# Altium project WSBR_Board.PrjPcb
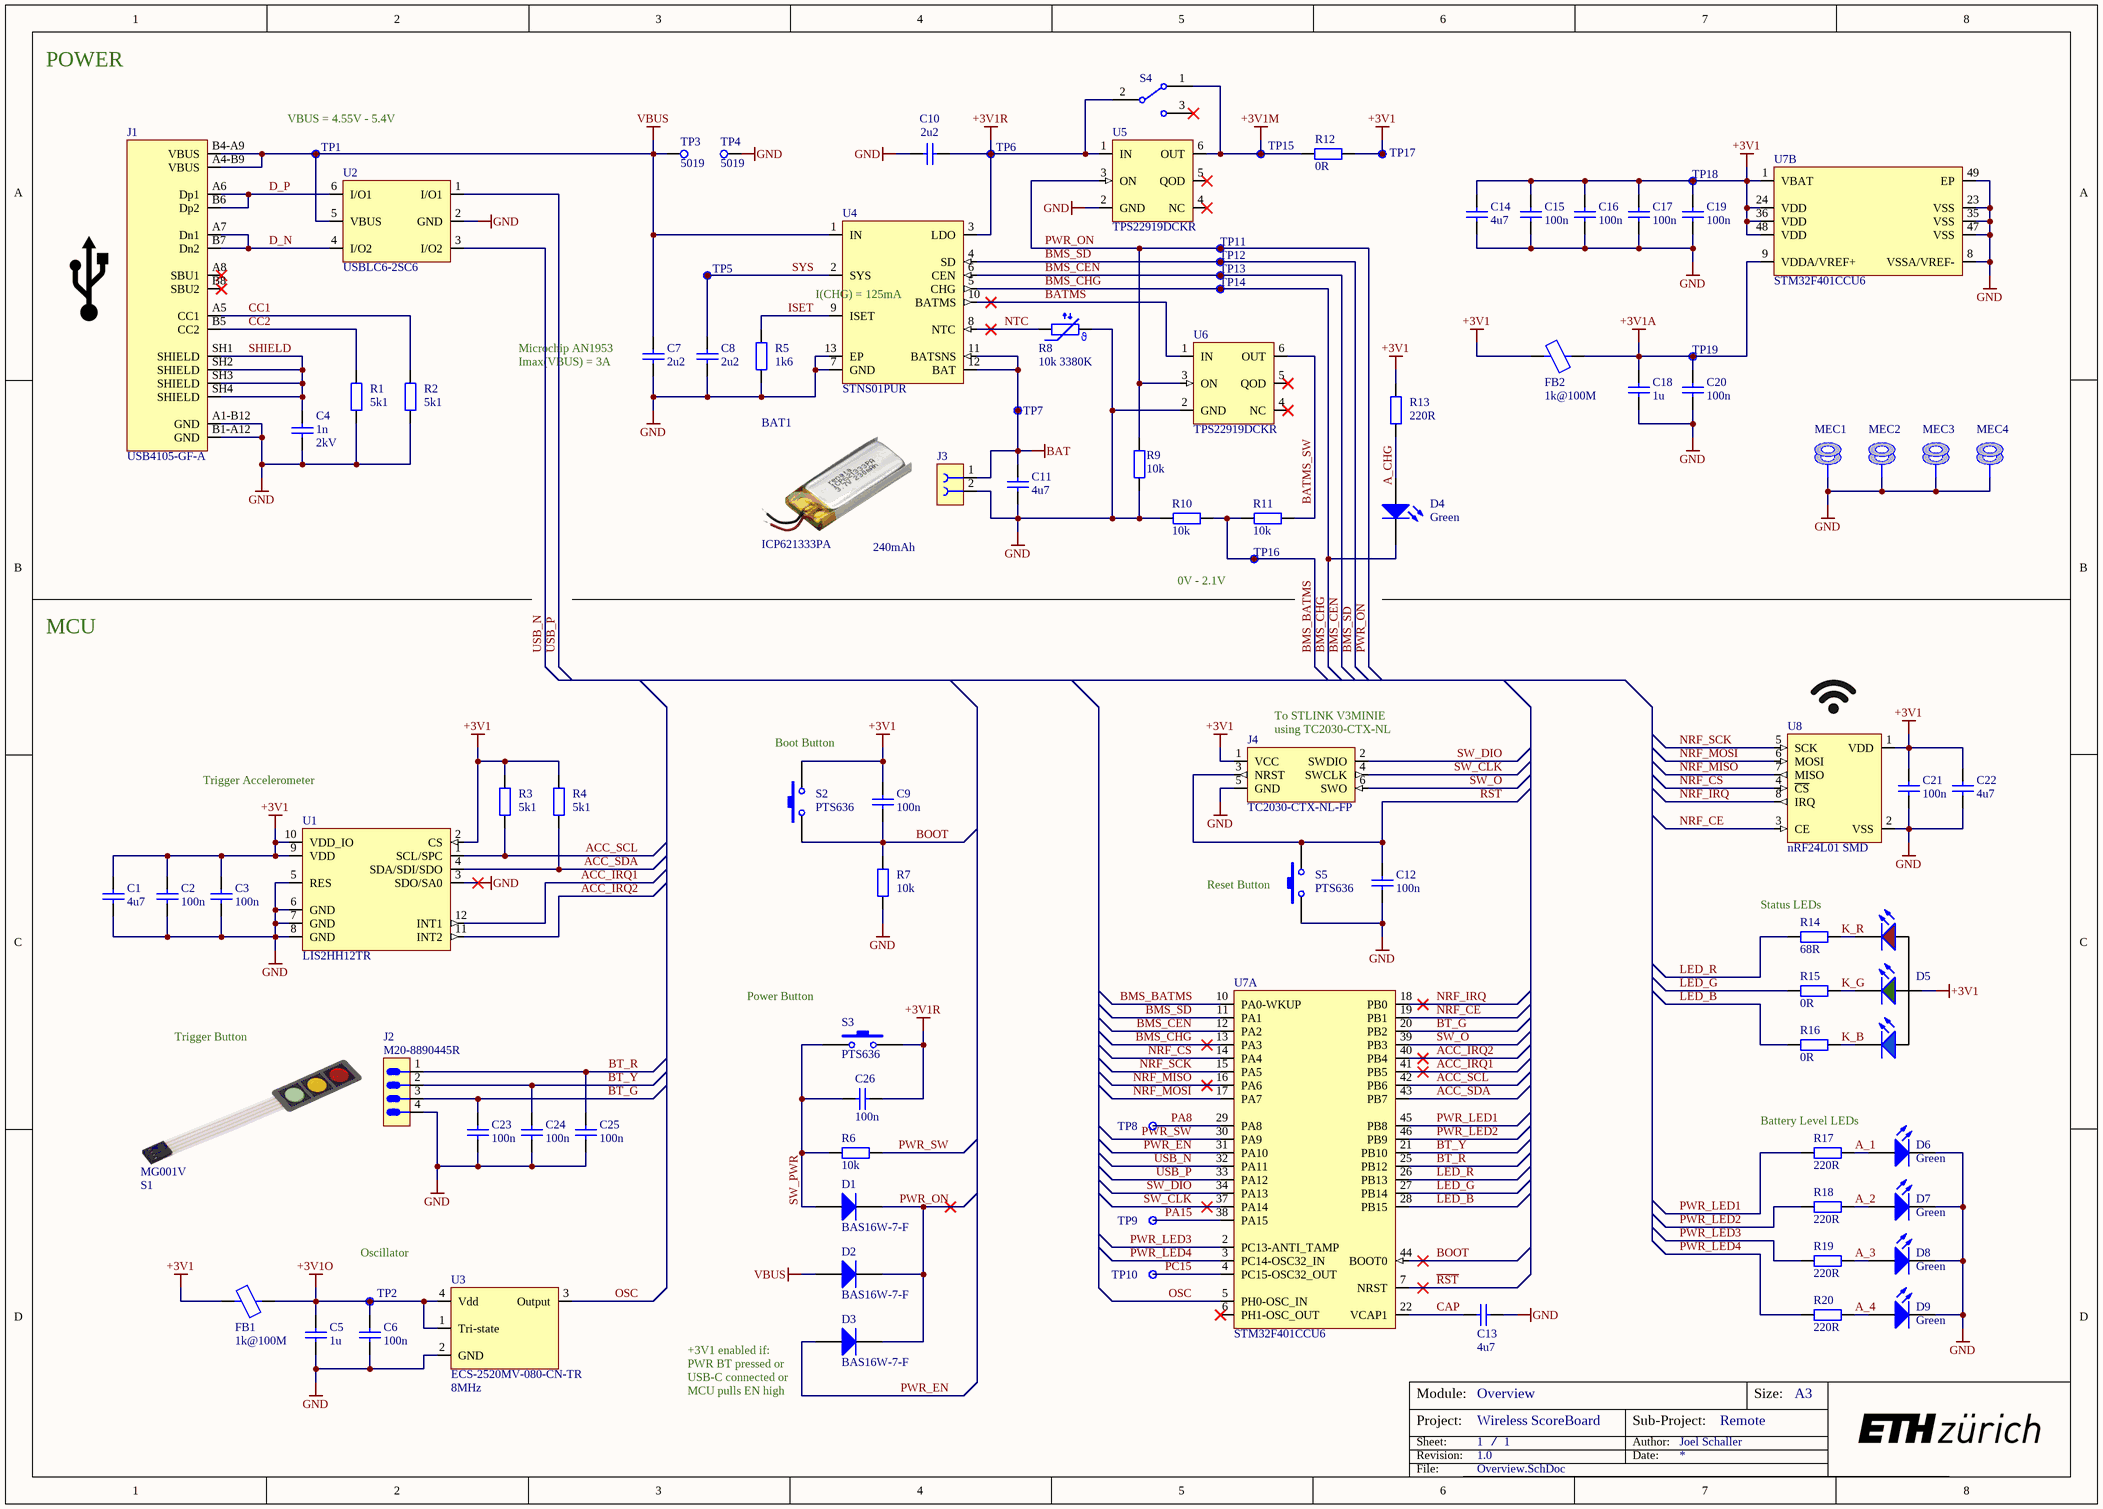
[diagram p0: Overview.SchDoc]
Author: Joel Schaller; Project: Wireless ScoreBoard; Revision: 1.0; SubProject: Remote
1 sheet, 98 parts. Net scope: global (net labels, ports and power ports of the same name join across sheets).
Board file: WSBR_Board.PcbDoc

## Sheet Overview.SchDoc
size A3; SheetNumber: 1; SheetTotal: 1; Module: Overview

### Parts
BAT1  ICP621333PA  value 240mAh  (mechanical)
C1  value 4u7  [SMD_CAPC2012X12N]  (hidden comment: C0805)
C2  value 100n  [SMD_CAPC1005X06N]  (hidden comment: C0402)
C3  value 100n  [SMD_CAPC1005X06N]  (hidden comment: C0402)
C4  value 1n  Note: 2kV  [SMD_CAPC3216X16N]  (hidden comment: C1206)
C5  value 1u  [SMD_CAPC2012X12N]  (hidden comment: C0805)
C6  value 100n  [SMD_CAPC1005X06N]  (hidden comment: C0402)
C7  value 2u2  [SMD_CAPC2012X12N]  (hidden comment: C0805)
C8  value 2u2  [SMD_CAPC2012X12N]  (hidden comment: C0805)
C9  value 100n  [SMD_CAPC1005X06N]  (hidden comment: C0402)
C10  value 2u2  [SMD_CAPC2012X12N]  (hidden comment: C0805)
C11  value 4u7  [SMD_CAPC2012X12N]  (hidden comment: C0805)
C12  value 100n  [SMD_CAPC1005X06N]  (hidden comment: C0402)
C13  value 4u7  [SMD_CAPC2012X12N]  (hidden comment: C0805)
C14  value 4u7  [SMD_CAPC2012X12N]  (hidden comment: C0805)
C15  value 100n  [SMD_CAPC1005X06N]  (hidden comment: C0402)
C16  value 100n  [SMD_CAPC1005X06N]  (hidden comment: C0402)
C17  value 100n  [SMD_CAPC1005X06N]  (hidden comment: C0402)
C18  value 1u  [SMD_CAPC2012X12N]  (hidden comment: C0805)
C19  value 100n  [SMD_CAPC1005X06N]  (hidden comment: C0402)
C20  value 100n  [SMD_CAPC1005X06N]  (hidden comment: C0402)
C21  value 100n  [SMD_CAPC1005X06N]  (hidden comment: C0402)
C22  value 4u7  [SMD_CAPC2012X12N]  (hidden comment: C0805)
C23  value 100n  [SMD_CAPC1005X06N]  (hidden comment: C0402)
C24  value 100n  [SMD_CAPC1005X06N]  (hidden comment: C0402)
C25  value 100n  [SMD_CAPC1005X06N]  (hidden comment: C0402)
C26  value 100n  [SMD_CAPC1005X06N]  (hidden comment: C0402)
D1  BAS16W-7-F  [SOT323 SC70]
D2  BAS16W-7-F  [SOT323 SC70]
D3  BAS16W-7-F  [SOT323 SC70]
D4  value Green  [SMD_LED_0402]  (hidden comment: APHHS1005LZGCK-V)
D5  APHF1608SEEQBDZGKC  [APHF1608SEEQBDZGKC]  (value not drawn)
D6  value Green  [SMD_LED_0402]  (hidden comment: APHHS1005LZGCK-V)
D7  value Green  [SMD_LED_0402]  (hidden comment: APHHS1005LZGCK-V)
D8  value Green  [SMD_LED_0402]  (hidden comment: APHHS1005LZGCK-V)
D9  value Green  [SMD_LED_0402]  (hidden comment: APHHS1005LZGCK-V)
FB1  value 1k@100M  [SMD_RESC1005X04N]  (hidden comment: BLM15BD102SN1D)
FB2  value 1k@100M  [SMD_RESC1005X04N]  (hidden comment: BLM15BD102SN1D)
J1  USB4105-GF-A  [USB4105-GF-A]
J2  M20-8890445R  [M20-8890445R]
J3  CONN SMD-PAD 2-Poles 1.6mm SMD  [CONN SMD-PAD 2-Poles 1.6mm SMD]  (value not drawn)  (no BOM)
J4  TC2030-CTX-NL-FP  [SMD_TAG-CONNECT_TC2030-CTX-NL]  (no BOM)
MEC1  Generic Screw Hole  [Screw M3 ISO 7380-1]  (value not drawn)  (no BOM)
MEC2  Generic Screw Hole  [Screw M3 ISO 7380-1]  (value not drawn)  (no BOM)
MEC3  Generic Screw Hole  [Screw M3 ISO 7380-1]  (value not drawn)  (no BOM)
MEC4  Generic Screw Hole  [Screw M3 ISO 7380-1]  (value not drawn)  (no BOM)
R1  value 5k1  [SMD_RESC1005X04N]  (hidden comment: R0402)
R2  value 5k1  [SMD_RESC1005X04N]  (hidden comment: R0402)
R3  value 5k1  [SMD_RESC1005X04N]  (hidden comment: R0402)
R4  value 5k1  [SMD_RESC1005X04N]  (hidden comment: R0402)
R5  value 1k6  [SMD_RESC1005X04N]  (hidden comment: R0402)
R6  value 10k  [SMD_RESC1005X04N]  (hidden comment: R0402)
R7  value 10k  [SMD_RESC1005X04N]  (hidden comment: R0402)
R8  value 10k 3380K  [SMD_RESC1005X04N]  (hidden comment: NCU15XH103F6SRC)
R9  value 10k  [SMD_RESC1005X04N]  (hidden comment: R0402)
R10  value 10k  [SMD_RESC1005X04N]  (hidden comment: R0402)
R11  value 10k  [SMD_RESC1005X04N]  (hidden comment: R0402)
R12  value 0R  [SMD_RESC1608X05N]  (hidden comment: R0603)
R13  value 220R  [SMD_RESC1005X04N]  (hidden comment: R0402)
R14  value 68R  [SMD_RESC1608X05N]  (hidden comment: R0603)
R15  value 0R  [SMD_RESC1608X05N]  (hidden comment: R0603)
R16  value 0R  [SMD_RESC1608X05N]  (hidden comment: R0603)
R17  value 220R  [SMD_RESC1005X04N]  (hidden comment: R0402)
R18  value 220R  [SMD_RESC1005X04N]  (hidden comment: R0402)
R19  value 220R  [SMD_RESC1005X04N]  (hidden comment: R0402)
R20  value 220R  [SMD_RESC1005X04N]  (hidden comment: R0402)
S1  MG001V  (mechanical)
S2  PTS636  [PTS636 SK43 SMTR LFS]
S3  PTS636  [PTS636 SK43 SMTR LFS]
S4  OS102011MS2QN1  [THT_SLIDESWITCH_86X43]  (value not drawn)
S5  PTS636  [PTS636 SK43 SMTR LFS]
TP1  Test Point  [SMD_PAD_1mm]  (value not drawn)  (no BOM)
TP2  Test Point  [SMD_PAD_1mm]  (value not drawn)  (no BOM)
TP3  5019  [KEYSTONE_5019]
TP4  5019  [KEYSTONE_5019]
TP5  Test Point  [SMD_PAD_1mm]  (value not drawn)  (no BOM)
TP6  Test Point  [SMD_PAD_1mm]  (value not drawn)  (no BOM)
TP7  Test Point  [SMD_PAD_1mm]  (value not drawn)  (no BOM)
TP8  Test Point  [SMD_PAD_1mm]  (value not drawn)  (no BOM)
TP9  Test Point  [SMD_PAD_1mm]  (value not drawn)  (no BOM)
TP10  Test Point  [SMD_PAD_1mm]  (value not drawn)  (no BOM)
TP11  Test Point  [SMD_PAD_1mm]  (value not drawn)  (no BOM)
TP12  Test Point  [SMD_PAD_1mm]  (value not drawn)  (no BOM)
TP13  Test Point  [SMD_PAD_1mm]  (value not drawn)  (no BOM)
TP14  Test Point  [SMD_PAD_1mm]  (value not drawn)  (no BOM)
TP15  Test Point  [SMD_PAD_1mm]  (value not drawn)  (no BOM)
TP16  Test Point  [SMD_PAD_1mm]  (value not drawn)  (no BOM)
TP17  Test Point  [SMD_PAD_1mm]  (value not drawn)  (no BOM)
TP18  Test Point  [SMD_PAD_1mm]  (value not drawn)  (no BOM)
TP19  Test Point  [SMD_PAD_1mm]  (value not drawn)  (no BOM)
U1  LIS2HH12TR  [LIS2HH12TR]
U2  USBLC6-2SC6  [SOT95P280X145-6N]
U3  ECS-2520MV-080-CN-TR  value 8MHz  [SMD_XTAL2520]
U4  STNS01PUR  [SON45P300X80_HS-13N]
U5  TPS22919DCKR  [SOT65P210X110-6N]
U6  TPS22919DCKR  [SOT65P210X110-6N]
U7  STM32F401CCU6  [QFN50P700X700X60_HS-49N]  (parts A,B of 2)
U8  nRF24L01 SMD  [nRF24L01 SMD]

### Nets
+3V1: C1.2 C2.2 C3.2 C9.2 C14.2 C15.2 C16.2 C17.2 C19.2 C21.2 C22.2 D5.1(A) FB1.1 FB2.1 J4.1(VCC) R3.2 R4.2 R12.1 R13.2 S2.2 TP17.1 TP18.1 U1.2(CS) U1.9(VDD) U1.10(VDD_IO) U7.1(VBAT) U7.24(VDD) U7.36(VDD) U7.48(VDD) U8.1(VDD)
+3V1A: C18.2 C20.2 FB2.2 TP19.1 U7.9(VDDA/VREF+)
+3V1M: R12.2 S4.1 TP15.1 U5.6(OUT)
+3V1O: C5.2 C6.2 FB1.2 TP2.1 U3.1(Tri-state) U3.4(Vdd)
+3V1R: C10.1 C26.1 S3.1 S4.2 TP6.1 U4.3(LDO) U5.1(IN)
BAT: C11.2 J3.1 TP7.1 U4.11(BATSNS) U4.12(BAT)
GND: C1.1 C2.1 C3.1 C4.1 C5.1 C6.1 C7.1 C8.1 C10.2 C11.1 C12.1 C13.1 C14.1 C15.1 C16.1 C17.1 C18.1 C19.1 C20.1 C21.1 C22.1 C23.1 C24.1 C25.1 D6.1(K) D7.1(K) D8.1(K) D9.1(K) J1.A1-B12(GND) J1.B1-A12(GND) J2.4 J3.2 J4.5(GND) MEC1.1 MEC2.1 MEC3.1 MEC4.1 R1.1 R2.1 R5.2 R7.2 R8.2 R9.1 R10.1 S5.1 TP4.1 U1.3(SDO/SA0) U1.5(RES) U1.6(GND) U1.7(GND) U1.8(GND) U2.2(GND) U3.2(GND) U4.7(GND) U4.13(EP) U5.2(GND) U6.2(GND) U7.8(VSSA/VREF-) U7.23(VSS) U7.35(VSS) U7.47(VSS) U7.49(EP) U8.2(VSS)
VBUS: C7.2 D2.1(A) J1.A4-B9(VBUS) J1.B4-A9(VBUS) TP1.1 TP3.1 U2.5(VBUS) U4.1(IN)
A_1: D6.2(A) R17.1
A_2: D7.2(A) R18.1
A_3: D8.2(A) R19.1
A_4: D9.2(A) R20.1
A_CHG: D4.2(A) R13.1
ACC_IRQ1: U1.12(INT1) U7.41(PB5)
ACC_IRQ2: U1.11(INT2) U7.40(PB4)
ACC_SCL: R3.1 U1.1(SCL/SPC) U7.42(PB6)
ACC_SDA: R4.1 U1.4(SDA/SDI/SDO) U7.43(PB7)
~{BMS_CHG}: D4.1(K) TP14.1 U4.5(CHG) U7.13(PA3)
BATMS: U4.10(BATMS) U6.1(IN)
BATMS_SW: R11.2 U6.6(OUT)
BMS_BATMS: R10.2 R11.1 TP16.1 U7.10(PA0-WKUP)
BMS_CEN: TP13.1 U4.6(CEN) U7.12(PA2)
BMS_SD: TP12.1 U4.4(SD) U7.11(PA1)
BOOT: C9.1 R7.1 S2.1 U7.44(BOOT0)
BT_G: C23.2 J2.3 U7.20(PB2)
BT_R: C25.2 J2.1 U7.25(PB12)
BT_Y: C24.2 J2.2 U7.21(PB10)
CAP: C13.2 U7.22(VCAP1)
CC1: J1.A5(CC1) R2.2
CC2: J1.B5(CC2) R1.2
D_N: J1.A7(Dn1) J1.B7(Dn2) U2.4(I/O2)
D_P: J1.A6(Dp1) J1.B6(Dp2) U2.6(I/O1)
ISET: R5.1 U4.9(ISET)
K_B: D5.3(K) R16.2
K_G: D5.4(K) R15.2
K_R: D5.2(K) R14.2
LED_B: R16.1 U7.28(PB15)
LED_G: R15.1 U7.27(PB14)
LED_R: R14.1 U7.26(PB13)
~{NRF_CS}: U7.14(PA4) U8.4(~{CS})
NRF_CE: U7.19(PB1) U8.3(CE)
NRF_IRQ: U7.18(PB0) U8.8(IRQ)
NRF_MISO: U7.16(PA6) U8.7(MISO)
NRF_MOSI: U7.17(PA7) U8.6(MOSI)
NRF_SCK: U7.15(PA5) U8.5(SCK)
NTC: R8.1 U4.8(NTC)
OSC: U3.3(Output) U7.5(PH0-OSC_IN)
PA8: TP8.1 U7.29(PA8)
PA15: TP9.1 U7.38(PA15)
PC15: TP10.1 U7.4(PC15-OSC32_OUT)
PWR_EN: D3.1(A) U7.31(PA10)
PWR_LED1: R17.2 U7.45(PB8)
PWR_LED2: R18.2 U7.46(PB9)
PWR_LED3: R19.2 U7.2(PC13-ANTI_TAMP)
PWR_LED4: R20.2 U7.3(PC14-OSC32_IN)
PWR_ON: D1.3(K) D2.3(K) D3.3(K) R9.2 TP11.1 U5.3(ON) U6.3(ON)
PWR_SW: R6.2 U7.30(PA9)
~{RST}: C12.2 J4.3(NRST) S5.2 U7.7(NRST)
SHIELD: C4.2 J1.SH1(SHIELD) J1.SH2(SHIELD) J1.SH3(SHIELD) J1.SH4(SHIELD)
SW_CLK: J4.4(SWCLK) U7.37(PA14)
SW_DIO: J4.2(SWDIO) U7.34(PA13)
SW_O: J4.6(SWO) U7.39(PB3)
SW_PWR: C26.2 D1.1(A) R6.1 S3.2
SYS: C8.2 TP5.1 U4.2(SYS)
USB_N: U2.3(I/O2) U7.32(PA11)
USB_P: U2.1(I/O1) U7.33(PA12)

Not connected (* = marked no-connect by the designer): J1 A8(SBU1)* B8(SBU2)*; S4 3*; U5 4(NC)* 5(QOD)*; U6 4(NC)* 5(QOD)*; U7 6(PH1-OSC_OUT)*

### Notes on the sheet
- POWER
- VBUS = 4.55V - 5.4V
- I(CHG) = 125mA
- (near R2) Microchip AN1953
- (near R2) Imax(VBUS) = 3A
- (near TP16) 0V - 2.1V
- MCU
- Trigger Accelerometer
- Boot Button
- (near J4) To STLINK V3MINIE
  using TC2030-CTX-NL
- (near S5) Reset Button
- (near R14) Status LEDs
- Trigger Button
- (near S3) Power Button
- Battery Level LEDs
- Oscillator
- (near D3) +3V1 enabled if:
  PWR BT pressed or
  USB-C connected or
  MCU pulls EN high
- Module:
- Size:
- A3
- Revision:
- Sheet:
- Project:
- /
- Sub-Project:
- Date:
- Author:
- File:
- (in symbol CMP-02981-1) ϑ

### Library data of the parts
BAT1 = CMP-03042-1: EMECH SINGLE BATTERY LIPO; Manufacturer: Renata; Manufacturer Part Number: ICP621333PA; Supplier: Conrad; Supplier Part Number: 252027 - UP; Supplier2: Distrelec; Supplier2 Part Number: ICP621333PA-01
C1 C11 C13 C14 C22 = CMP-02451-1: CERCAP 4u7 25V 10% X7R 0805; Manufacturer: YAGEO; Manufacturer Part Number: CC0805KKX7R8BB475; Supplier: Digi-Key; Supplier Part Number: 311-1885-1-ND; Supplier2: Mouser; Supplier2 Part Number: 603-CC805KKX7R8BB475
C2 C3 C6 C9 C12 C15-C17 C19-C21 C23-C26 = CMP-02708-2: CERCAP 100n 50V 10% X7R 0402; Manufacturer: YAGEO; Manufacturer Part Number: CC0402KRX7R9BB104; Note: 50V; Supplier: Digi-Key; Supplier Part Number: 311-3566-1-ND; Supplier2: Mouser; Supplier2 Part Number: 603-CC402KRX7R9BB104
C4 = CMP-02123-1: CERCAP 1n 2kV 10% X7R 1206; Manufacturer: Würth Elektronik; Manufacturer Part Number: 885342208024; Supplier: Digi-Key; Supplier Part Number: 732-885342208024CT-ND; Supplier2: Mouser; Supplier2 Part Number: 710-885342208024
C5 C18 = CMP-02451-1: CERCAP 1u 25V 10% X7R 0805; Manufacturer: YAGEO; Manufacturer Part Number: CC0805KKX7R8BB105; Supplier: Digi-Key; Supplier Part Number: 311-1456-1-ND; Supplier2: Mouser; Supplier2 Part Number: 603-CC805KKX7R8BB105
C7 C8 C10 = CMP-02451-1: CERCAP 2u2 25V 10% X7R 0805; Manufacturer: YAGEO; Manufacturer Part Number: CC0805KKX7R8BB225; Supplier: Digi-Key; Supplier Part Number: 311-1884-1-ND; Supplier2: Mouser; Supplier2 Part Number: 603-CC805KKX7R8BB225
D1-D3 = CMP-03049-1: DIODE 200mW 75V 300mA SOT-323; Manufacturer: Diodes Incorporated; Supplier2: Mouser; Supplier Part Number: BAS16W-FDICT-ND; Supplier2 Part Number: 621-BAS16W-F; Supplier: Digi-Key; Manufacturer Part Number: BAS16W-7-F
D4 D6-D9 = CMP-01377-1: LED GREEN 2mA 2.65V 0402; Manufacturer: Kingbright; Manufacturer Part Number: APHHS1005LZGCK-V; Supplier: DigiKey; Supplier Part Number: 754-2126-1-ND; Supplier2: Mouser; Supplier2 Part Number: 604-APHHS1005LZGCK-V
D5 = CMP-02821-1: LED RGB 20mA 3.3V 1.6x0.8mm; Manufacturer: Kingbright; Manufacturer Part Number: APHF1608SEEQBDZGKC; Supplier: Digi-Key; Supplier Part Number: 754-2144-1-ND; Supplier2: Mouser; Supplier2 Part Number: 604-APHF1608QBDZGKC
FB1 FB2 = CMP-03004-1: FERRITE 200mA-1k 0402; Manufacturer: Murata Electronics; Note: 1.5kR@100MHz; Supplier Part Number: 490-1010-1-ND; Supplier: Digi-Key; Supplier2 Part Number: 81-BLM15BD102SN1D; Supplier2: Mouser; Manufacturer Part Number: BLM15BD102SN1D
J1 = CMP-02911-1: CONN Female USB-C 16x Horizontal SMD; Manufacturer: GCT; Manufacturer Part Number: USB4105-GF-A; Supplier: Digi-Key; Supplier Part Number: 2073-USB4105-GF-ACT-ND; Supplier2: Mouser; Supplier2 Part Number: 640-USB4105-GF-A
J2 = CMP-02820-1: CONN Male 4-Poles 2.54mm Horizontal SMD; Manufacturer: Harwin Inc.; Manufacturer Part Number: M20-8890445R; Supplier: Digi-Key; Supplier Part Number: 952-M20-8890445RCT-ND; Supplier2: Mouser; Supplier2 Part Number: 855-M20-8890445
J3 = CMP-02986-2
J4 = CMPL-001-0427-A.2: TP TAG-CONNECT 7.6x9mm
MEC1-MEC4 = CMPL-001-0477-A.7: EMECH Generic Screw Hole - different sizes
R1-R4 = CMP-02880-1: RES 5k1 62.5mW 1% 0402; Manufacturer: YAGEO; Manufacturer Part Number: RC0402FR-075K1L; Supplier: Digi-Key; Supplier Part Number: 311-5.10KLRCT-ND; Supplier2: Mouser; Supplier2 Part Number: 603-RC0402FR-075K1L
R5 = CMP-02880-1: RES 1k6 62.5mW 1% 0402; Manufacturer: YAGEO; Manufacturer Part Number: RC0402FR-071K6L; Supplier: Digi-Key; Supplier Part Number: YAG3045CT-ND; Supplier2: Mouser; Supplier2 Part Number: 603-RC0402FR-071K6L
R6 R7 R9-R11 = CMP-02880-1: RES 10k 62.5mW 1% 0402; Manufacturer: YAGEO; Manufacturer Part Number: RC0402FR-0710KL; Supplier: Digi-Key; Supplier Part Number: 311-10.0KLRCT-ND; Supplier2: Mouser; Supplier2 Part Number: 603-RC0402FR-0710KL
R8 = CMP-02981-1: RES NTC 10k 3380K; Manufacturer: Murata Electronics; Manufacturer Part Number: NCU15XH103F6SRC; Supplier: Digi-Key; Supplier Part Number: 490-NCU15XH103F6SRCCT-ND; Supplier2: Mouser; Supplier2 Part Number: 81-NCU15XH103F6SRC
R12 R15 R16 = CMPL-001-0142-A.2: RES 0R 0603; Manufacturer: YAEGO; Manufacturer Part Number: RC0603FR-070RL; Supplier: Digi-Key; Supplier Part Number: 311-0.0HRCT-ND; Supplier2: Mouser; Supplier2 Part Number: 603-RC0603FR-070RL
R13 R17-R20 = CMP-02880-1: RES 220R 62.5mW 1% 0402; Manufacturer: YAGEO; Manufacturer Part Number: RC0402FR-07220RL; Supplier: Digi-Key; Supplier Part Number: 311-220LRCT-ND; Supplier2: Mouser; Supplier2 Part Number: 603-RC0402FR-07220RL
R14 = CMPL-001-0142-A.2: RES 68R 0603; Manufacturer: YAEGO; Manufacturer Part Number: RC0603FR-0768RL; Supplier: Digi-Key; Supplier Part Number: 311-68.0HRCT-ND; Supplier2: Mouser; Supplier2 Part Number: 603-RC0603FR-0768RL
S1 = CMP-03043-2: EMECH TRIPLE MEMBRANE KEYS; Manufacturer: JESSINIE; Manufacturer Part Number: MG001V; Supplier: AliExpress; Supplier Part Number: MG001V / 3 Key RYG; Supplier2: Amazon; Supplier2 Part Number: JESSINIE MG001V
S2 S3 S5 = CMP-03040-1: BUTTON SPST 12V 50mA 6x3.5x4.3mm; Manufacturer: C&K; Manufacturer Part Number: PTS636 SK43 SMTR LFS; Supplier: Digi-Key; Supplier Part Number: CKN12311-1-ND; Supplier2: Mouser; Supplier2 Part Number: 611-PTS636SK43SMTRLF
S4 = CMPL-001-0005-3: SWITCH SPDT 12V 0.1A 4.3x8.6mm; Manufacturer: C&K; Manufacturer Part Number: OS102011MS2QN1; Supplier: Digi-Key; Supplier Part Number: CKN9565-ND
TP1 TP2 TP5-TP19 = CMP-02902-2: TP TESTPOINT MULTIPLE_SIZE
TP3 TP4 = CMPL-001-0505-9: TP SMD 3.81x 2.03mm; Manufacturer: Keystone Electronics; Design Item ID: 5019; Source: 5019.SchLib; Manufacturer Part Number: 5019; Supplier: Digi-Key; Supplier Part Number: 36-5019CT-ND
U1 = CMP-03024-1: SENSOR accelerometer 1.7-3.6V LGA-12; Manufacturer: STMicroelectronics; Manufacturer Part Number: LIS2HH12TR; Supplier: Digi-Key; Supplier Part Number: 497-15069-1-ND; Supplier2: Mouser; Supplier2 Part Number: 511-LIS2HH12TR
U2 = CMP-02913-1: IC Dual ESD Protection SOT23-6; Manufacturer: STMicroelectronics; Manufacturer Part Number: USBLC6-2SC6; Note: ESD; Supplier: Digi-Key; Supplier Part Number: 497-5235-1-ND; Supplier2: Mouser; Supplier2 Part Number: 511-USBLC6-2SC6
U3 = CMP-02862-3: OSC 8MHz Enable/Disable 1.6V-3.6V 4-SMD 2.5x2mm; Manufacturer: ECS Inc.; Manufacturer Part Number: ECS-2520MV-080-CN-TR; Supplier: Digi-Key; Supplier Part Number: XC3029CT-ND
U4 = CMPL-001-0518-A.2: Charger Single LiIon 5.4V 12-DFN; Manufacturer: STMicroelectronics; Manufacturer Part Number: STNS01PUR; Supplier: Digi-Key; Supplier Part Number: 497-13880-1-ND; Supplier2: Mouser; Supplier2 Part Number: 511-STNS01PUR
U5 U6 = CMPL-001-0510-A.1: POWER-DISTRIBUTION Single Switch 5.5V SOT363; Manufacturer: Texas Instruments; Manufacturer Part Number: TPS22919DCKR; Supplier: Digi-Key; Supplier Part Number: 296-TPS22919DCKRCT-ND; Supplier2: Mouser; Supplier2 Part Number: 595-TPS22919DCKR
U7 = CMP-03026-1: MCU ARM-Cortex-M4 256kB_FLASH 64kB_RAM 1.7-3.6V UFQFPN48; Manufacturer: STMicroelectronics; Manufacturer Part Number: STM32F401CCU6; Supplier: Digi-Key; Supplier Part Number: 497-17426-ND; Supplier2: Mouser; Supplier2 Part Number: 511-STM32F401CCU6; PartId: 1
U8 = CMP-03044-1: RF Module SPI; Manufacturer: Nordic Semiconductor ASA; Manufacturer Part Number: nRF24L01 SMD; Supplier: AliExpress; Supplier Part Number: nRF24L01 SMD

## Assembly variants
default: not fitted R? R? R? S?